# Altium schematic sheet ICE.SchDoc
size A4
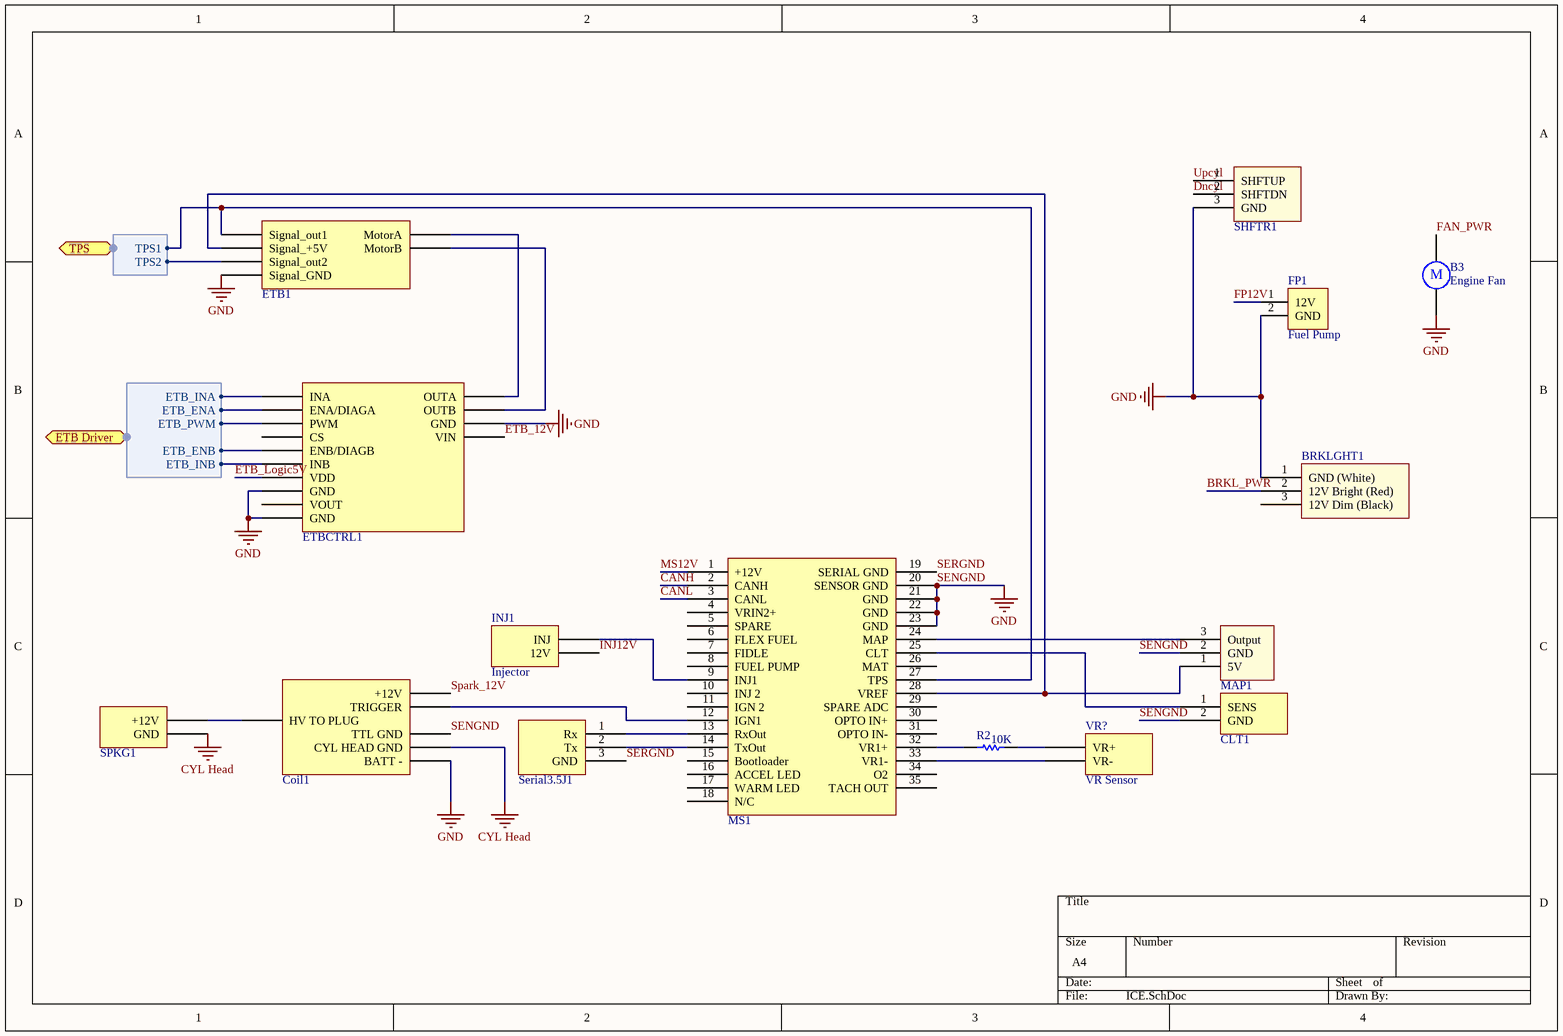
[diagram p0: ICE.SchDoc]

## Parts
B3  Engine Fan  [RB5-10.5]
BRKLGHT1  BRKLGHT  (value not drawn)
CLT1  CLT  (value not drawn)
Coil1  Spark Plug Coil  (value not drawn)
ETB1  ETB  (value not drawn)
ETBCTRL1  ETB Controller  (value not drawn)
FP1  Fuel Pump  [HDR1X2]
INJ1  Injector
MAP1  MAP  (value not drawn)
MS1  Microsquirt  (value not drawn)
R2  value 10K  [AXIAL-0.3]  (hidden comment: Res1)
Serial3.5J1  Serial Jack  (value not drawn)
SHFTR1  Shifter  (value not drawn)
SPKG1  Spark Plug  (value not drawn)
VR?  VR Sensor

## Ports
ETB Driver (harness ETB Harness), TPS (harness TPS)

## Harnesses
ETB Harness: ETB_INA, ETB_INB, ETB_ENA, ETB_ENB, ETB_PWM
TPS: TPS2, TPS1

## Nets
CYL Head: Coil1.6(CYL_HEAD_GND) SPKG1.2(GND)
SENGND: B3.2 BRKLGHT1.1(GND_(White)) CLT1.2(GND) Coil1.2(TTL_GND) Coil1.4(BATT_-) ETB1.4(Signal_GND) ETBCTRL1.3(GND) ETBCTRL1.12(GND) ETBCTRL1.14(GND) FP1.2(GND) MAP1.2(GND) MS1.20(SENSOR_GND) MS1.21(GND) MS1.22(GND) MS1.23(GND) SHFTR1.3(GND)  [also labelled GND]
BRKL_PWR: BRKLGHT1.2(12V_Bright_(Red))
CANH: MS1.2(CANH)
CANL: MS1.3(CANL)
Dncyl: SHFTR1.2(SHFTDN)
ETB_12V: ETBCTRL1.4(VIN)
ETB_Logic5V: ETBCTRL1.11(VDD)
FAN_PWR: B3.1
FP12V: FP1.1(12V)
INJ12V: INJ1.2(12V)
MS12V: MS1.1(+12V)
SERGND: MS1.19(SERIAL_GND) Serial3.5J1.3(GND)
Spark_12V: Coil1.1(+12V)
Upcyl: SHFTR1.1(SHFTUP)
NetCLT1_1: CLT1.1(SENS) MS1.25(CLT)
NetCoil1_3: Coil1.3(HV_TO_PLUG) SPKG1.1(+12V)
NetCoil1_5: Coil1.5(TRIGGER) MS1.12(IGN1)
NetETB1_1: ETB1.1(Signal_out1) MS1.27(TPS) ; port TPS.TPS1
NetETB1_2: ETB1.2(Signal_+5V) MAP1.1(5V) MS1.28(VREF)
NetETB1_3: ETB1.3(Signal_out2) ; port TPS.TPS2
NetETB1_5: ETB1.5(MotorA) ETBCTRL1.1(OUTA)
NetETB1_6: ETB1.6(MotorB) ETBCTRL1.2(OUTB)
NetETBCTRL1_5: ETBCTRL1.5(INA) ; port ETB Driver.ETB_INA
NetETBCTRL1_6: ETBCTRL1.6(ENA/DIAGA) ; port ETB Driver.ETB_ENA
NetETBCTRL1_7: ETBCTRL1.7(PWM) ; port ETB Driver.ETB_PWM
NetETBCTRL1_9: ETBCTRL1.9(ENB/DIAGB) ; port ETB Driver.ETB_ENB
NetETBCTRL1_10: ETBCTRL1.10(INB) ; port ETB Driver.ETB_INB
NetINJ1_1: INJ1.1(INJ) MS1.9(INJ1)
NetMAP1_3: MAP1.3(Output) MS1.24(MAP)
NetMS1_13: MS1.13(RxOut) Serial3.5J1.1(Rx)
NetMS1_14: MS1.14(TxOut) Serial3.5J1.2(Tx)
NetMS1_32: MS1.32(VR1+) R2.1
NetMS1_33: MS1.33(VR1-) VR?.2(VR-)
NetR2_2: R2.2 VR?.1(VR+)

Not connected (* = marked no-connect by the designer): BRKLGHT1 3(12V_Dim_(Black)); ETBCTRL1 8(CS) 13(VOUT); MS1 4(VRIN2+) 5(SPARE) 6(FLEX_FUEL) 7(FIDLE) 8(FUEL_PUMP) 10(INJ_2) 11(IGN_2) 15(Bootloader) 16(ACCEL_LED) 17(WARM_LED) 18(N/C) 26(MAT) 29(SPARE_ADC) 30(OPTO_IN+) 31(OPTO_IN-) 34(O2) 35(TACH_OUT)

## Notes on the sheet
- (in symbol Motor) M

## Library data of the parts
B3 = Motor: Motor, General Kind; Published: 24-Mar-1999; LatestRevisionDate: 17-Jul-2002; LatestRevisionNote: Re-released for DXP Platform.; PackageReference: RB5-10.5; Publisher: Altium Limited; PackageDescription: Capacitor (Radial); 2 Leads
BRKLGHT1 = BRKLGHT: Brake light with dim and bright operation
CLT1 = CLT: Coolant Temperature Sensor
ETB1 = ETB: Electronic Throttle Body
ETBCTRL1 = ETB Controller: ETB Controller Board
FP1 = Header 2: Header, 2-Pin; LatestRevisionDate: 17-Jul-2002; LatestRevisionNote: Re-released for DXP Platform.; Publisher: Altium Limited
MAP1 = VSS: Manifold Air Pressure Sensor
MS1 = Microsquirt: Microsquirt EFI Controller
R2 = Res1: Resistor; Published: 8-Jun-2000; LatestRevisionDate: 17-Jul-2002; LatestRevisionNote: Re-released for DXP Platform.; PackageReference: AXIAL-0.3; Publisher: Altium Limited; PackageDescription: Axial Device, Thru-Hole; 2 Leads; 0.3 in Pin Spacing
Serial3.5J1 = Serial Connector: Serial Connector on a 3.5mm plug
SHFTR1 = SHFTR: Shifter Connector
SPKG1 = Spark Plug: Spark Plug with HV Lead Connector
VR? = VR Sensor: Variable Reluctance Sensor